# Altium project QSTL_M12C_BNC.PrjPcb
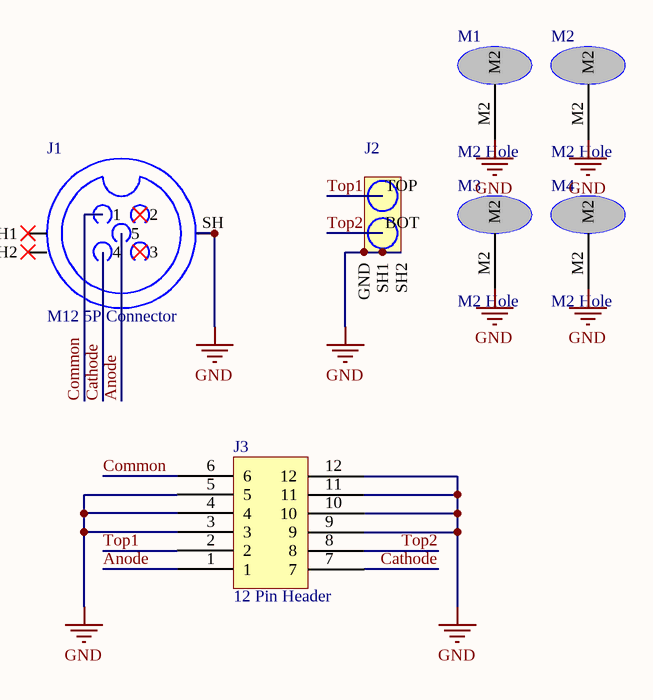
[diagram p0: QSTL_M12C_BNC.SchDoc]
1 sheet, 7 parts. Net scope: global (net labels, ports and power ports of the same name join across sheets).
Board file: QSTL_M12C_BNC.PcbDoc

## Sheet QSTL_M12C_BNC.SchDoc
size 127 x 127 mm; SheetNumber: 1; SheetTotal: 1

### Parts
J1  M12 5P Connector  [861-B05-213R004]
J2  Stacked BNC  [031-6590]  (value not drawn)
J3  12 Pin Header  [PZ254-2-06-S]
M1  M2 Hole  [M2_Hole]
M2  M2 Hole  [M2_Hole]
M3  M2 Hole  [M2_Hole]
M4  M2 Hole  [M2_Hole]

### Nets
GND: J1.SH J2.GND J2.SH1 J2.SH2 J3.3 J3.4 J3.5 J3.9 J3.10 J3.11 J3.12 M1.M2 M2.M2 M3.M2 M4.M2
Anode: J1.5 J3.1
Cathode: J1.4 J3.7
Common: J1.1 J3.6
Top1: J2.TOP J3.2
Top2: J2.BOT J3.8

Not connected (* = marked no-connect by the designer): J1 2* 3* MH1 MH2

### Library data of the parts
J1 = 861-B05-213R004: https://www.digikey.ca/en/products/detail/norcomp-inc/861-B05-213R004/22611951?s=N4IgTCBcDaIBwDYCMBaAQgBgKwrEgzAEoYYAsIAugL5A
J2 = 031-6590: https://www.digikey.ca/en/products/detail/amphenol-rf/031-6590/4037245
J3 = PZ254-2-06-S: https://jlcpcb.com/partdetail/HCTL-PZ254_2_06S/C3294464
M1-M4 = M2_Hole